# EAGLE schematic BMD-200_eval (EAGLE 6.6.0)
GCN: 3.1; PCBNAME: BMD-200_eval; PROJECT: BMD-200
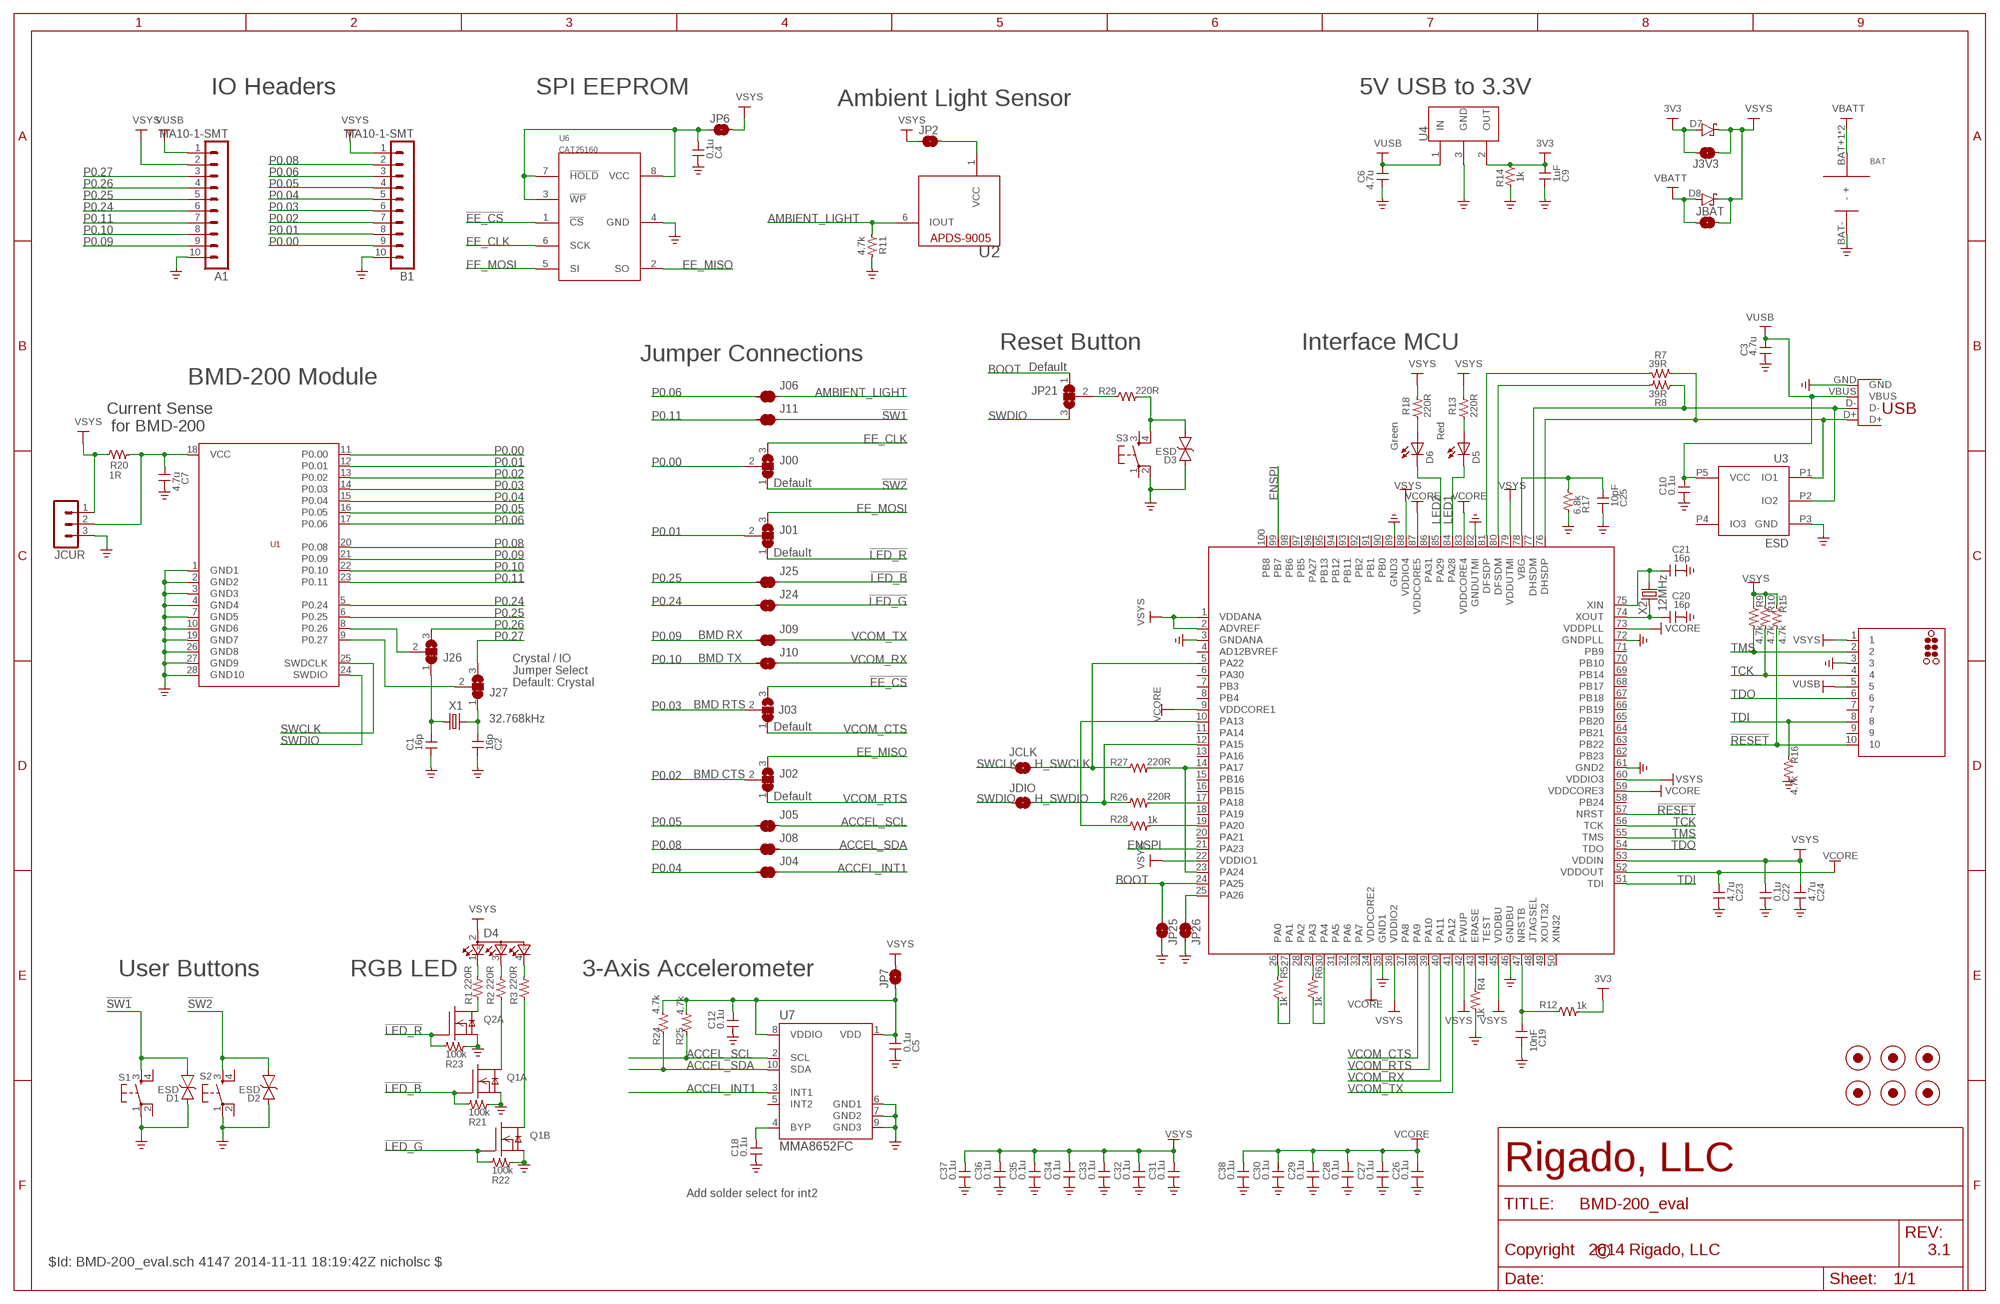
[diagram p0: schematic, sheet 1]

## Parts
A1  MA10-1-SMT  [MA10-A-SMT]
B1  MA10-1-SMT  [MA10-A-SMT]
BAT  COINCELL-1  [CR2032-1]
C1  16p  C-0402  [SMD0402]
C2  16p  C-0402  [SMD0402]
C3  4.7u  C-0603  [SMD0603]
C4  0.1u  C-0402  [SMD0402]
C5  0.1u  C-0402  [SMD0402]
C6  4.7u  C-0603  [SMD0603]
C7  4.7u  C-0603  [SMD0603]
C9  1uF  C-0402  [SMD0402]
C10  0.1u  C-0402  [SMD0402]
C12  0.1u  C-0402  [SMD0402]
C18  0.1u  C-0402  [SMD0402]
C19  10nF  C-0402  [SMD0402]
C20  16p  C-0402  [SMD0402]
C21  16p  C-0402  [SMD0402]
C22  0.1u  C-0402  [SMD0402]
C23  4.7u  C-0603  [SMD0603]
C24  4.7u  C-0603  [SMD0603]
C25  10pF  C-0402  [SMD0402]
C26  0.1u  C-0402  [SMD0402]
C27  0.1u  C-0402  [SMD0402]
C28  0.1u  C-0402  [SMD0402]
C29  0.1u  C-0402  [SMD0402]
C30  0.1u  C-0402  [SMD0402]
C31  0.1u  C-0402  [SMD0402]
C32  0.1u  C-0402  [SMD0402]
C33  0.1u  C-0402  [SMD0402]
C34  0.1u  C-0402  [SMD0402]
C35  0.1u  C-0402  [SMD0402]
C36  0.1u  C-0402  [SMD0402]
C37  0.1u  C-0402  [SMD0402]
C38  0.1u  C-0402  [SMD0402]
D1  ESD  ESDSOD-923  [SOD-923]
D2  ESD  ESDSOD-923  [SOD-923]
D3  ESD  ESDSOD-923  [SOD-923]
D4  RGD_LED  TOPLED-3-MIN  [P-LLC-4-SMALL]
D5  Red  LED-0603  [LED0603]
D6  Green  LED-0603  [LED0603]
D7  D-SCHOTTKY-SOD-123  [SOD-123]
D8  D-SCHOTTKY-SOD-123  [SOD-123]
FID1  FIDUCIAL-.04  [FIDUCIAL-.04]
FID2  FIDUCIAL-.04  [FIDUCIAL-.04]
FID3  FIDUCIAL-.04  [FIDUCIAL-.04]
FID4  FIDUCIAL-.04  [FIDUCIAL-.04]
FID5  FIDUCIAL-.04  [FIDUCIAL-.04]
FID6  FIDUCIAL-.04  [FIDUCIAL-.04]
J00  SOLDER_JUMPER_2WAY-TRACE12  [SJ_2WAY_TRACE]
J01  SOLDER_JUMPER_2WAY-TRACE12  [SJ_2WAY_TRACE]
J02  SOLDER_JUMPER_2WAY-TRACE12  [SJ_2WAY_TRACE]
J03  SOLDER_JUMPER_2WAY-TRACE12  [SJ_2WAY_TRACE]
J3V3  SOLDER_JUMPER  [SJ_2]
J04  SOLDER_JUMPER-TRACE  [SJ_2_TRACE]
J05  SOLDER_JUMPER-TRACE  [SJ_2_TRACE]
J06  SOLDER_JUMPER-TRACE  [SJ_2_TRACE]
J08  SOLDER_JUMPER-TRACE  [SJ_2_TRACE]
J09  SOLDER_JUMPER-TRACE  [SJ_2_TRACE]
J10  SOLDER_JUMPER-TRACE  [SJ_2_TRACE]
J11  SOLDER_JUMPER-TRACE  [SJ_2_TRACE]
J24  SOLDER_JUMPER-TRACE  [SJ_2_TRACE]
J25  SOLDER_JUMPER-TRACE  [SJ_2_TRACE]
J26  SOLDER_JUMPER_2WAY-TRACE12  [SJ_2WAY_TRACE]
J27  SOLDER_JUMPER_2WAY-TRACE12  [SJ_2WAY_TRACE]
JBAT  SOLDER_JUMPER  [SJ_2]
JCLK  SOLDER_JUMPER-TRACE  [SJ_2_TRACE]
JCUR  MA03-1SMT  [MA03-1-SMT]
JDIO  SOLDER_JUMPER-TRACE  [SJ_2_TRACE]
JP2  SOLDER_JUMPER-TRACE  [SJ_2_TRACE]
JP6  SOLDER_JUMPER  [SJ_2]
JP7  SOLDER_JUMPER-TRACE  [SJ_2_TRACE]
JP21  SOLDER_JUMPER_2WAY-TRACE12  [SJ_2WAY_TRACE]
JP25  SOLDER_JUMPER  [SJ_2]
JP26  SOLDER_JUMPER  [SJ_2]
JTAG  TC2050-NL  [TC2050-MCP-NL]
JUSB  USB-MICROB-2  [USB-MICROB-2]
Q1  DUAL-NFET-SOT563  [SOT-563]
Q2  DUAL-NFET-SOT563  [SOT-563]
R1  220R  R-0402  [SMD0402]
R2  220R  R-0402  [SMD0402]
R3  220R  R-0402  [SMD0402]
R4  1k  R-0402  [SMD0402]
R5  1k  R-0402  [SMD0402]
R6  1k  R-0402  [SMD0402]
R7  39R  R-0402  [SMD0402]
R8  39R  R-0402  [SMD0402]
R9  4.7k  R-0402  [SMD0402]
R10  4.7k  R-0402  [SMD0402]
R11  4.7k  R-0402  [SMD0402]
R12  1k  R-0402  [SMD0402]
R13  220R  R-0402  [SMD0402]
R14  1k  R-0402  [SMD0402]
R15  4.7k  R-0402  [SMD0402]
R16  4.7k  R-0402  [SMD0402]
R17  6.8k  R-0402  [SMD0402]
R18  220R  R-0402  [SMD0402]
R20  1R  R-0805  [SMD0805]
R21  100k  R-0402  [SMD0402]
R22  100k  R-0402  [SMD0402]
R23  100k  R-0402  [SMD0402]
R24  4.7k  R-0402  [SMD0402]
R25  4.7k  R-0402  [SMD0402]
R26  220R  R-0402  [SMD0402]
R27  220R  R-0402  [SMD0402]
R28  1k  R-0402  [SMD0402]
R29  220R  R-0402  [SMD0402]
S1  10-XXTL3301-GW  [ESWITCH-TL3301-GW]
S2  10-XXTL3301-GW  [ESWITCH-TL3301-GW]
S3  10-XXTL3301-GW  [ESWITCH-TL3301-GW]
U1  BMD-200  [BMD-200]
U2  APDS9005  [APDS9005]
U3  ESD  TPD3E001  [TPD3E001]
U4  VREG-SOT23  [SOT-23-3]
U6  CAT25160  CAT25512  [SOIC-8N]
U7  MMA8652FC  [DFN-10_2X2]
U8  ATSAM3C-TQFP  [TQFP100]
X1  32.768kHz  CRYSTAL2SMD  [2SMD]
X2  12MHz  CRYSTAL-3.2X2.5MM  [3225]

## Nets
3V3: C9.2 D7.A J3V3.2 R12.2 R14.1 U4.2(OUT)
5V0: A1.1 C3.2 C6.1 C10.2 JTAG.5 JUSB.VBUS U3.P5(VCC) U4.1(IN) ; supply symbol labelled VUSB
!EE_CS: J03.3 U6.1(!CS)
!LED_B: J25.2 Q1.2(A:G) R21.2
!LED_G: J24.2 Q1.5(B:G) R22.2
!LED_R: J01.1 Q2.2(A:G) R23.2
!RESET: JTAG.10 R15.2 U8.57(NRST)
!SW1: D1.C J11.2 S1.3(S)
!SW2: D2.C J00.1 S2.3(S)
ACCEL_INT1: J04.2 U7.3(INT1)
ACCEL_SCL: J05.2 R25.1 U7.2(SCL)
ACCEL_SDA: J08.2 R24.1 U7.10(SDA)
AMBIENT_LIGHT: J06.2 R11.1 U2.6(IOUT)
BOOT: JP21.1 JP25.1 U8.24(PA25)
EE_CLK: J00.3 U6.6(SCK)
EE_MISO: J02.3 U6.2(SO)
EE_MOSI: J01.3 U6.5(SI)
ENSPI: U8.21(PA23) U8.99(PB7)
GND [Planes]: A1.10 B1.10 BAT.BAT-(-) C1.1 C2.1 C3.1 C4.1 C5.1 C6.2 C7.2 C9.1 C10.1 C12.1 C18.1 C19.2 C20.1 C21.1 C22.1 C23.1 C24.1 C25.1 C26.1 C27.1 C28.1 C29.1 C30.1 C31.1 C32.1 C33.1 C34.1 C35.1 C36.1 C37.1 C38.1 D1.A D2.A D3.A JCUR.3 JP25.2 JP26.2 JTAG.3 JUSB.GND Q1.1(A:S) Q1.4(B:S) Q2.1(A:S) R4.2 R11.2 R14.2 R16.2 R17.2 R21.1 R22.1 R23.1 S1.1(P) S2.1(P) S3.2(P1) U1.1(GND1) U1.2(GND2) U1.3(GND3) U1.4(GND4) U1.7(GND5) U1.10(GND6) U1.19(GND7) U1.26(GND8) U1.27(GND9) U1.28(GND10) U3.P3(GND) U4.3(GND) U6.4(GND) U7.6(GND1) U7.7(GND2) U7.9(GND3) U8.3(GNDANA) U8.35(GND1) U8.46(GNDBU) U8.61(GND2) U8.72(GNDPLL) U8.82(GNDUTMI) U8.89(GND3)
H_SWCLK: JCLK.1 R27.1 U8.5(PA22)
H_SWDIO: JDIO.1 R26.1 U8.12(PA15)
LED1: D5.C U8.84(PA28)
LED2: D6.C U8.85(PA29)
N$1: D4.1(CRED) R1.2
N$2: D4.3(CBLUE) R2.2
N$3: J26.2 U1.8(P0.26)
N$4: C7.1 JCUR.2 R20.2 U1.18(VCC)
N$5: D4.4(CGREEN) R3.2
N$8: C4.2 JP6.1 U6.3(!WP) U6.7(!HOLD) U6.8(VCC)
N$9: R5.1 U8.26(PA0)
N$10: D6.A R18.1
N$11: R5.2 U8.27(PA1)
N$14: JP2.2 U2.1(VCC)
N$16: R6.1 U8.29(PA3)
N$17: C18.2 U7.4(BYP)
N$19: C2.2 J27.1 X1.2
N$20: C1.2 J26.1 X1.1
N$21: D5.A R13.1
N$22: C5.2 C12.2 JP7.1 R24.2 R25.2 U7.1(VDD) U7.8(VDDIO)
N$23: J27.2 U1.9(P0.27)
N$24: R6.2 U8.30(PA4)
N$25: C20.2 U8.74(XOUT) X2.1
N$28: R4.1 U8.43(ERASE)
N$29: JP26.1 U8.25(PA26)
N$30: C19.1 R12.1 U8.47(NRSTB)
N$31: C21.2 U8.75(XIN) X2.3
N$32: C25.2 R17.1 U8.78(VBG)
N$33: Q2.6(A:D) R1.1
N$34: Q1.6(A:D) R2.1
N$35: Q1.3(B:D) R3.1
N$36: R26.2 U8.17(PA18)
N$37: R27.2 U8.14(PA17) U8.23(PA24)
N$40: R28.1 U8.10(PA13)
N$41: R28.2 U8.19(PA20)
N$47: D3.C R29.2 S3.4(S1)
N$48: JP21.2 R29.1
P0.00: B1.9 J00.2 U1.11(P0.00)
P0.01: B1.8 J01.2 U1.12(P0.01)
P0.02: B1.7 J02.2 U1.13(P0.02)
P0.03: B1.6 J03.2 U1.14(P0.03)
P0.04: B1.5 J04.1 U1.15(P0.04)
P0.05: B1.4 J05.1 U1.16(P0.05)
P0.06: B1.3 J06.1 U1.17(P0.06)
P0.08: B1.2 J08.1 U1.20(P0.08)
P0.09: A1.9 J09.1 U1.21(P0.09)
P0.10: A1.8 J10.1 U1.22(P0.10)
P0.11: A1.7 J11.1 U1.23(P0.11)
P0.24: A1.6 J24.1 U1.5(P0.24)
P0.25: A1.5 J25.1 U1.6(P0.25)
P0.26: A1.4 J26.3
P0.27: A1.3 J27.3
SWCLK: JCLK.2 U1.25(SWDCLK)
SWDIO: JDIO.2 JP21.3 U1.24(SWDIO)
TCK: JTAG.4 R10.2 U8.56(TCK)
TDI: JTAG.8 R16.1 U8.51(TDI)
TDO: JTAG.6 U8.54(TDO)
TMS: JTAG.2 R9.2 U8.55(TMS)
USBHS_N [usb]: R8.2 U8.80(DFSDM)
USBHS_P [usb]: R7.2 U8.81(DFSDP)
USBP_N [usb]: JUSB.D- R8.1 U3.P2(IO2) U8.77(DHSDM)
USBP_P [usb]: JUSB.D+ R7.1 U3.P1(IO1) U8.76(DHSDP)
VBATT: BAT.BAT+1(+) BAT.BAT+2(+) D8.A JBAT.1
VCOM_CTS: J03.1 U8.38(PA9)
VCOM_RTS: J02.1 U8.39(PA10)
VCOM_RX: J10.2 U8.40(PA11)
VCOM_TX: J09.2 U8.41(PA12)
VCORE: C23.2 C26.2 C27.2 C28.2 C29.2 C30.2 C38.2 U8.9(VDDCORE1) U8.34(VDDCORE2) U8.52(VDDOUT) U8.59(VDDCORE3) U8.73(VDDPLL) U8.83(VDDCORE4) U8.87(VDDCORE5)
VSYS: A1.2 B1.1 C22.2 C24.2 C31.2 C32.2 C33.2 C34.2 C35.2 C36.2 C37.2 D4.2(A2) D7.C D8.C J3V3.1 JBAT.2 JCUR.1 JP2.1 JP6.2 JP7.2 JTAG.1 R9.1 R10.1 R13.2 R15.1 R18.2 R20.1 U8.1(VDDANA) U8.2(ADVREF) U8.22(VDDIO1) U8.36(VDDIO2) U8.42(FWUP) U8.45(VDDBU) U8.53(VDDIN) U8.60(VDDIO3) U8.79(VDDUTMI) U8.88(VDDIO4)
Unconnected: JTAG.7 JTAG.9 Q2.3(B:D) Q2.4(B:S) Q2.5(B:G) S1.2(P1) S1.4(S1) S2.2(P1) S2.4(S1) S3.1(P) S3.3(S) U3.P4(IO3) U7.5(INT2) U8.4(AD12BVREF) U8.6(PA30) U8.7(PB3) U8.8(PB4) U8.11(PA14) U8.13(PA16) U8.15(PB16) U8.16(PB15) U8.18(PA19) U8.20(PA21) U8.28(PA2) U8.31(PA5) U8.32(PA6) U8.33(PA7) U8.37(PA8) U8.44(TEST) U8.48(JTAGSEL) U8.49(XOUT32) U8.50(XIN32) U8.58(PB24) U8.62(PB23) U8.63(PB22) U8.64(PB21) U8.65(PB20) U8.66(PB19) U8.67(PB18) U8.68(PB17) U8.69(PB14) U8.70(PB10) U8.71(PB9) U8.86(PA31) U8.90(PB0) U8.91(PB1) U8.92(PB2) U8.93(PB11) U8.94(PB12) U8.95(PB13) U8.96(PA27) U8.97(PB5) U8.98(PB6) U8.100(PB8)

## Notes on the sheet
- IO Headers | SPI EEPROM | 5V USB to 3.3V
- Ambient Light Sensor
- Reset Button | Interface MCU
- Jumper Connections
- Default
- BMD-200 Module
- Current Sense
   for BMD-200
- Default
- Default
- BMD RX
- BMD TX
- Crystal / IO
  Jumper Select
  Default: Crystal
- BMD RTS
- Default
- BMD CTS
- Default
- User Buttons | RGB LED | 3-Axis Accelerometer
- Add solder select for int2
- 3.1
- $Id: BMD-200_eval.sch 4147 2014-11-11 18:19:42Z nicholsc $

## Library data of the parts
A1 B1 = rigado-connectors:MA10-1; DESCRIPTION: 10 SIL VERT SMT HDR; EACH: 0.441; MFPN: M20-8771042; MFR: Harwin; VEND: Digikey; VPN: M20-8771042-ND
BAT = rigado-connectors:COINCELL; DESCRIPTION: Battery Holders, Clips & Contacts Linx CR2032 Battery Holder; EACH: 0.197; MFPN: BAT-HLD-001; MFR: Linx; VEND: Mouser; VPN: 712-BAT-HLD-001
C1 C2 C20 C21 = c:C; DESCRIPTION: CAP CER 16PF 50V 5% NP0 0402; EACH: 0.003; MFPN: CL05C160JB5NCNC; MFR: Samsung; VEND: Digikey; VPN: 1276-1645-1-ND
C3 C6 C7 C23 C24 = c:C; DESCRIPTION: CAP CER 4.7UF 6.3V 10% X5R 0603; EACH: 0.022; MFPN: GRM188R60J475KE19D; MFR: Murata; VEND: Digikey; VPN: 490-3297-1-ND
C4 C5 C10 C12 C18 C22 C26-C38 = c:C; DESCRIPTION: CAP CER 0.1UF 6.3V 10% X5R 0402; EACH: 0.003; MFPN: CL05A104KQ5NNNC; MFR: Samsung; VEND: Digikey; VPN: 1276-1442-1-ND
C9 = c:C; DESCRIPTION: CAP CER 1UF 6.3V 5% X5R 0402; EACH: 0.006; MFPN: CL05A105JQ5NNNC; MFR: Samsung; VEND: Digikey; VPN: 1276-1444-1-ND
C19 = c:C; DESCRIPTION: CAP CER 10000PF 16V 10% X7R 0402; EACH: 0.00325; MFPN: CL05B103KO5NCNC; MFR: Samsung; VEND: Digikey; VPN: 1276-1500-1-ND
C25 = c:C; DESCRIPTION: CAP CER 10PF 50V 5% NP0 0402; EACH: 0.00227; MFPN: CL05C100JB5NNNC; MFR: Samsung; VEND: Digikey; VPN: 1276-1139-1-ND
D1-D3 = d:ESD; DESCRIPTION: TVS DIODE 3.3VWM SOD923; EACH: 0.04234; MFPN: ESD9B3.3ST5G; MFR: On Semi; VEND: Digikey; VPN: ESD9B3.3ST5GOSCT-ND
D4 = rigado-led:TOPLED-3: OSRAM - Hyper Multi TOPLED® (RGB) LB E673, LV E673, LT E673 - Power TOPLED® Enhanced optical Power LED (HOP2000) LS E67B, LA E67B, LO E67B, LY E67B - Hyper Multi TOPLED® Enhanced optical Power LED (HOP2000 / ATON®) LATB T66B - Hyper Multi TOPLED® Hyper-Bright LED LATB T686 Source: http://www.osram.convergy.de/; DESCRIPTION: LED RGB SMD DIFF 4-PLCC; EACH: 0.391; MFPN: CLVBA-FKA-CA1D181BB7R3R3; MFR: Cree; VEND: Digikey; VPN: CLVBA-FKA-CA1D181BB7R3R3CT-ND
D5 = rigado-led:LED; DESCRIPTION: LED 1.6X0.8MM 625NM RED CLR SMD; EACH: 0.078; MFPN: APT1608EC; MFR: Kingbright; VEND: Digikey; VPN: 754-1117-1-ND
D6 = rigado-led:LED; DESCRIPTION: LED 1.6X0.8MM 568NM GRN CLR SMD; EACH: 0.078; MFPN: APT1608SGC; MFR: Kingbright; VEND: Digikey; VPN: 754-1121-1-ND
D7 D8 = d:D-SCHOTTKY; DESCRIPTION: DIODE SCHOTTKY 20V 0.5A SOD123; EACH: 0.0647; MFPN: MBR0520LT3G; MFR: ON Semi; VEND: Digikey; VPN: MBR0520LT3GOSCT-ND
FID1-FID6 = rigado-pcb:FIDUCIAL
J00 J01-J03 J26 J27 JP21 = rigado-connectors:SOLDER_JUMPER_2WAY
J3V3 J04-J06 J08 J09 J10 J11 J24 J25 JBAT JCLK JDIO JP2 JP6 JP7 JP25 JP26 = rigado-connectors:SOLDER_JUMPER
JCUR = rigado-connectors:MA03-1: PIN HEADER; DESCRIPTION: 3POS SIL VERTICAL SMT HEADER; EACH: 0.1408; MFPN: M20-8770342; MFR: Harwin; VEND: Digikey; VPN: 952-1951-ND
JTAG = rigado-connectors:TC2050: TAG-CONNECT ISP Connector Manufacturer: Tag-Connect <www.tag-connect.com> Cable for easy In-Circuit PCB Programming. Designed for Microchip ICD2, suitable for many others.
JUSB = rigado-connectors:USB: USB Connectors USB-B-PTH is fully proven SKU : PRT-00139 USB-miniB is fully proven SKU : PRT-00587 USB-A-PCB is untested. USB-A-H is throughly reviewed, but untested. Spark Fun Electronics SKU : PRT-00437 USB-B-SMT is throughly reviewed, but untested. Needs silkscreen touching up. USB-A-S has not been used/tested USB-MB-H has not been used/tested; DESCRIPTION: CONN USB MICRO B RECPT SMT R/A; EACH: 0.26; MFPN: 10118192-0001LF; MFR: FCI; VEND: Digikey; VPN: 609-4613-1-ND
Q1 = rigado-fet:DUAL-NFET; DESCRIPTION: MOSFET 2N-CH 20V 0.18A ES6; EACH: 0.0988; MFPN: SSM6N35FE,LM; MFR: Toshiba; VEND: Digikey; VPN: SSM6N35FELMCT-ND
Q2 = rigado-fet:DUAL-NFET; DESCRIPTION: MOSFET 2N-CH 20V 0.18A ES7; EACH: 0.0988; MFPN: SSM6N35FE,LM; MFR: Toshiba; VEND: Digikey; VPN: SSM6N35FELMCT-ND
R1-R3 R13 R18 = r:R; DESCRIPTION: RES 220 OHM 1/16W 5% 0402; EACH: 0.0023; MFPN: RC1005J221CS; MFR: Samsung; VEND: Digikey; VPN: 1276-4360-1-ND
R4-R6 R12 R14 R28 = r:R; DESCRIPTION: RES 1K OHM 1/16W 5% 0402; EACH: 0.0023; MFPN: RC1005J102CS; MFR: Samsung; VEND: Digikey; VPN: 1276-4376-1-ND
R7 R8 = r:R; DESCRIPTION: RES 39 OHM 1/16W 5% 0402; EACH: 0.0023; MFPN: RC1005J390CS; MFR: Samsung; VEND: Digikey; VPN: 1276-4342-1-ND
R9-R11 R15 R16 R24 R25 = r:R; DESCRIPTION: RES 4.7K OHM 1/16W 5% 0402; EACH: 0.0023; MFPN: RC1005J472CS; MFR: Samsung; VEND: Digikey; VPN: 1276-4392-1-ND
R17 = r:R; DESCRIPTION: RES 6.8K OHM 1/16W 1% 0402; EACH: 0.00432; MFPN: RC1005F682CS; MFR: Samsung; VEND: Digikey; VPN: 1276-4098-1-ND
R20 = r:R; DESCRIPTION: RES 1.00 OHM 1/8W 1% 0805 SMD; EACH: 0.00513; MFPN: RC0805FR-071RL; MFR: Yageo; VEND: Digikey; VPN: 311-1.00CRCT-ND
R21-R23 = r:R; DESCRIPTION: RES 100K OHM 1/16W 5% 0402; EACH: 0.0031; MFPN: RC1005J104CS; MFR: Samsung; VEND: Digikey; VPN: 1276-4424-1-ND
R26 = r:R; DESCRIPTION: RES 220 OHM 1/16W 5% 0403; EACH: 0.0023; MFPN: RC1005J221CS; MFR: Samsung; VEND: Digikey; VPN: 1276-4360-1-ND
R27 = r:R; DESCRIPTION: RES 220 OHM 1/16W 5% 0404; EACH: 0.0023; MFPN: RC1005J221CS; MFR: Samsung; VEND: Digikey; VPN: 1276-4360-1-ND
R29 = r:R; DESCRIPTION: RES 220 OHM 1/16W 5% 0405; EACH: 0.0023; MFPN: RC1005J221CS; MFR: Samsung; VEND: Digikey; VPN: 1276-4360-1-ND
S1-S3 = rigado-switches:10-XX: Tact. Switch; DESCRIPTION: SWITCH TACTILE SPST-NO 0.05A 12V; EACH: 0.231; MFPN: TL3301AF160QG; MFR: E-Switch; VEND: Digikey; VPN: EG2526TR-ND
U1 = BMD-200:BMD-200; DESCRIPTION: BLE Module w/ nRF51822 SoC; MFPN: BMD-200; MFR: Rigado
U2 = rigado-sensors:APDS9005; DESCRIPTION: AMBIENT LIGHT SENSOR 6CHIPLED; EACH: 0.75584; MFPN: APDS-9005-020; MFR: Avago; VEND: Digikey; VPN: 516-1717-2-ND
U3 = rigado-interface-ic:TPD3E001; DESCRIPTION: TVS DIODE SOT5; EACH: 0.158; MFPN: TPD3E001DRLR; MFR: TI; VEND: Digikey; VPN: 296-21885-1-ND
U4 = rigado-power:VREG: Low Drop Linear Regulator; DESCRIPTION: IC REG LDO 3.3V 0.3A SOT23-3; EACH: 0.144; MFPN: AP7333-33SAG-7; MFR: Diodes Incorporated; VEND: Digikey; VPN: AP7333-33SAG-7DICT-ND
U6 = rigado-flash:CAT25512; DESCRIPTION: IC EEPROM 16KBIT 20MHZ 8SOIC; EACH: 0.165; MFPN: CAT25160VI-GT3; MFR: ON Semi; VEND: Digikey; VPN: CAT25160VI-GT3CT-ND
U7 = rigado-sensors:MMA8652FC; DESCRIPTION: IC ACCELEROMETER 3AXIS 10DFN; EACH: 0.767; MFPN: MMA8652FCR1; MFR: Freescale; VEND: Digikey; VPN: MMA8652FCR1CT-ND
U8 = rigado-mcu:ATSAM3C; DESCRIPTION: IC MCU 32BIT 128KB FLASH 100LQFP; EACH: 4.246; MFPN: ATSAM3U2CA-AU; MFR: Atmel; VEND: Digikey; VPN: ATSAM3U2CA-AU-ND
X1 = rigado-crystal:CRYSTAL: CRYSTAL; DESCRIPTION: CRYSTAL 32.768KHZ 12.5PF SMD; EACH: 0.36; MFPN: ST3215SB32768H5HPWAA; MFR: AVX; VEND: Digikey; VPN: 478-5428-1-ND
X2 = rigado-crystal:CRYSTAL: CRYSTAL; DESCRIPTION: CRYSTAL 12MHZ 18PF SMD; EACH: 0.6615; MFPN: 7M-12.000MAAJ-T; MFR: TXC; VEND: Digikey; VPN: 887-1121-1-ND

## Net classes
1 usb: width 0.356 mm, clearance 0.254 mm to class 0
6 Planes: clearance 0.508 mm to class 1